# EAGLE schematic Input Board (EAGLE 7.4.0)
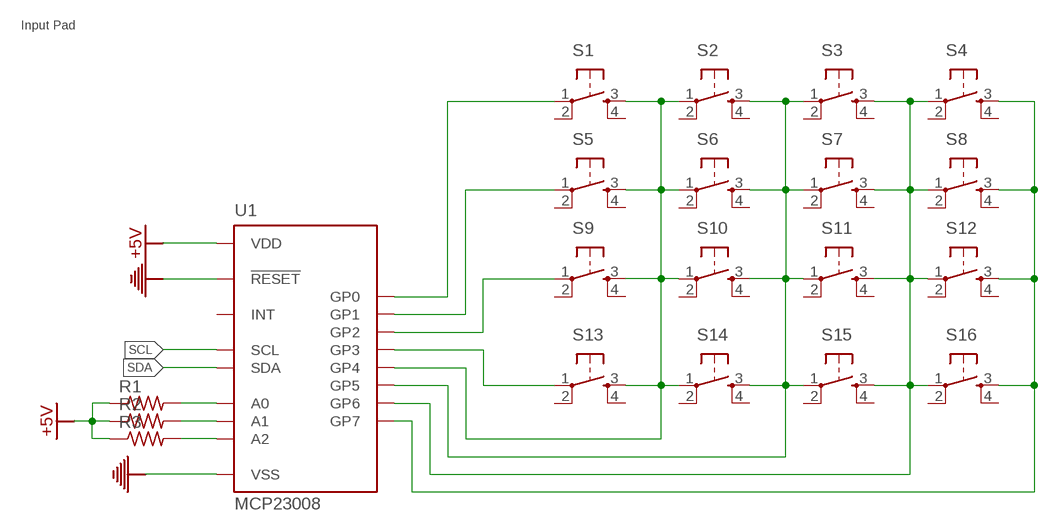
[diagram p0: schematic, sheet 1]

## Parts
R1  R-US_M0805  [M0805]
R2  R-US_M0805  [M0805]
R3  R-US_M0805  [M0805]
S1  TAC_SWITCHPTH  [TACTILE-PTH]
S2  TAC_SWITCHPTH  [TACTILE-PTH]
S3  TAC_SWITCHPTH  [TACTILE-PTH]
S4  TAC_SWITCHPTH  [TACTILE-PTH]
S5  TAC_SWITCHPTH  [TACTILE-PTH]
S6  TAC_SWITCHPTH  [TACTILE-PTH]
S7  TAC_SWITCHPTH  [TACTILE-PTH]
S8  TAC_SWITCHPTH  [TACTILE-PTH]
S9  TAC_SWITCHPTH  [TACTILE-PTH]
S10  TAC_SWITCHPTH  [TACTILE-PTH]
S11  TAC_SWITCHPTH  [TACTILE-PTH]
S12  TAC_SWITCHPTH  [TACTILE-PTH]
S13  TAC_SWITCHPTH  [TACTILE-PTH]
S14  TAC_SWITCHPTH  [TACTILE-PTH]
S15  TAC_SWITCHPTH  [TACTILE-PTH]
S16  TAC_SWITCHPTH  [TACTILE-PTH]
U1  MCP23008  [SOIC]

## Nets
+5V: R1.1 R2.1 R3.1 U1.P$18(VDD)
GND: U1.P$6(!RESET) U1.P$9(VSS)
N$1: S3.3 S4.1 S7.3 S8.1 S11.3 S12.1 S15.3 S16.1 U1.P$16(GP6)
N$3: S1.1 U1.P$10(GP0)
N$4: S5.1 U1.P$11(GP1)
N$5: S9.1 U1.P$12(GP2)
N$6: S13.1 U1.P$13(GP3)
N$7: S1.3 S2.1 S5.3 S6.1 S9.3 S10.1 S13.3 S14.1 U1.P$14(GP4)
N$8: S2.3 S3.1 S6.3 S7.1 S10.3 S11.1 S14.3 S15.1 U1.P$15(GP5)
N$13: S4.3 S8.3 S12.3 S16.3 U1.P$17(GP7)
N$15: R3.2 U1.P$3(A2)
N$16: R2.2 U1.P$4(A1)
N$17: R1.2 U1.P$5(A0)
SCL: U1.P$1(SCL)
SDA: U1.P$2(SDA)
Unconnected: S1.2 S1.4 S2.2 S2.4 S3.2 S3.4 S4.2 S4.4 S5.2 S5.4 S6.2 S6.4 S7.2 S7.4 S8.2 S8.4 S9.2 S9.4 S10.2 S10.4 S11.2 S11.4 S12.2 S12.4 S13.2 S13.4 S14.2 S14.4 S15.2 S15.4 S16.2 S16.4 U1.P$8(INT)

## Notes on the sheet
- Input Pad

## Library data of the parts
R1-R3 = resistor:R-US_: RESISTOR, American symbol
S1-S16 = SparkFun:TAC_SWITCH: Momentary Switch Button commonly used for reset or general input. Spark Fun Electronics SKU : COM-00097
U1 = Jeremy:MCP23008: MCP23008 8-Bit I/O Expander I2C Interface ADDR: S0100XXX